# EAGLE schematic Tinker Slider v1.0 (EAGLE 9.0.0)
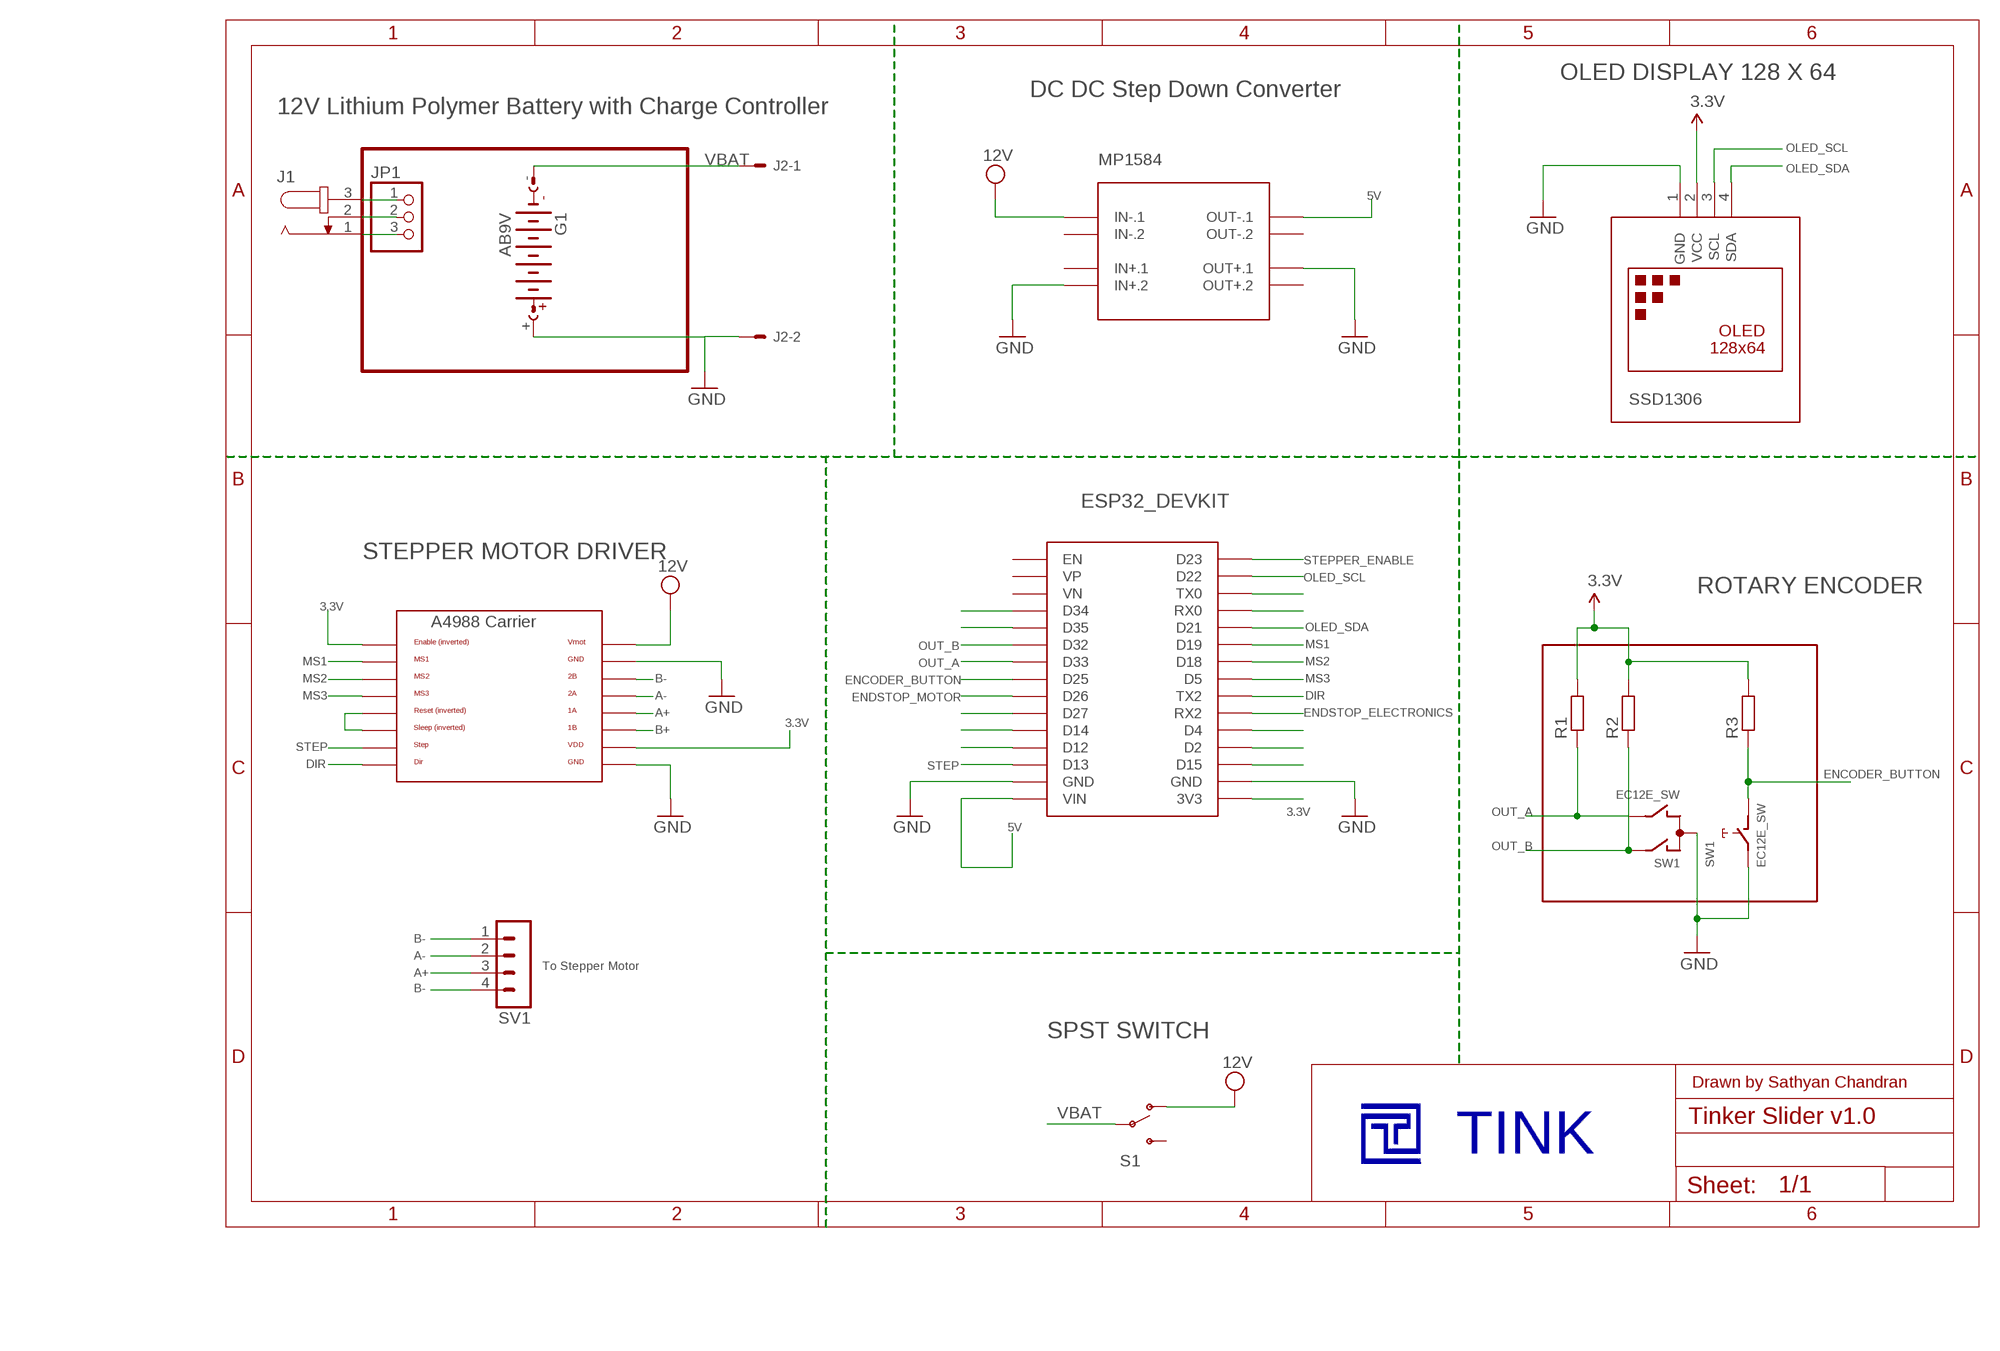
[diagram p0: schematic, sheet 1]

## Parts
G1  AB9V  [AB9V]
J1  JACK-PLUG0  [SPC4077]
J2  22-27-2021-02  [6410-02]
JP1  PINHD-1X3  [1X03]
MP1584  DC-DC-STEP-DOWN-MP1584  [DC-DC-STEP-DOWN-MP1584]
R1  R-EU_R0805  [R0805]
R2  R-EU_R0805  [R0805]
R3  R-EU_R0805  [R0805]
S1  SWITCH-SPSTKIT  [SWITCH-SPDT_KIT]
SSD1306  DISPLAY-OLED-128X64-I2C  [DISPLAY-OLED-128X64-I2C]
SV1  MA04-1  [MA04-1]
SW1  EC12E_SW  [ALPS_EC12E_SW]
U$3  ESP32_DEVKIT  [ESP32_DEVKIT]
U$5  A4983CARRIER  [A4988BREAKOUT]

## Nets
3.3V: U$3.3V3 U$5.EN U$5.VDD
5V: MP1584.OUT-.1 U$3.VIN
A+: SV1.3 U$5.1A
A-: SV1.2 U$5.2A
B+: U$5.1B
B-: SV1.1 SV1.4 U$5.2B
DIR: U$3.TX2 U$5.DIR
ENCODER_BUTTON: R3.1 SW1.D U$3.D25
ENDSTOP_ELECTRONICS: U$3.RX2
ENDSTOP_MOTOR: U$3.D26
GND: G1.+ J2.2 MP1584.IN+.2 MP1584.OUT+.1 SSD1306.1(GND) SW1.C SW1.E U$3.GND@1(GND) U$3.GND@2(GND) U$5.GND U$5.GND@0(GND)
MS1: U$3.D19 U$5.MS1
MS2: U$3.D18 U$5.MS2
MS3: U$3.D5 U$5.MS3
N$4: U$3.D34
N$5: U$3.D35
N$7: U$5.RST U$5.SLP(SLEEP)
N$10: U$3.D27
N$11: U$3.D14
N$12: U$3.D12
N$18: U$3.D15
N$19: U$3.D2
N$20: U$3.D4
N$27: U$3.RX0
N$28: U$3.TX0
N$31: J1.3 JP1.1
N$32: J1.2 JP1.2
N$33: J1.1 JP1.3
OLED_SCL: SSD1306.3(SCL) U$3.D22
OLED_SDA: SSD1306.4(SDA) U$3.D21
OUT_A: R1.1 SW1.B U$3.D33
OUT_B: R2.1 SW1.A U$3.D32
STEP: U$3.D13 U$5.STEP
STEPPER_ENABLE: U$3.D23
VBAT: G1.- J2.1 S1.2(P)
VCC: MP1584.IN-.1 R1.2 R2.2 R3.2 S1.1(O) SSD1306.2(VCC) U$5.VMOT ; supply symbol labelled 3.3V, 12V
Unconnected: MP1584.IN+.1 MP1584.IN-.2 MP1584.OUT+.2 MP1584.OUT-.2 S1.3(S) SW1.GND1(G) SW1.GND2(G) U$3.EN U$3.VN U$3.VP

## Notes on the sheet
- OLED DISPLAY 128 X 64
- DC DC Step Down Converter
- 12V Lithium Polymer Battery with Charge Controller
- STEPPER MOTOR DRIVER
- ROTARY ENCODER
- To Stepper Motor
- SPST SWITCH
- Drawn by Sathyan Chandran
- TINK
- F:/TinkMind/Website/bitmap.bmp

## Library data of the parts
G1 = battery:AB9V: 9-V BATTERY CLIP
J1 = con-jack:JACK-PLUG: DC POWER JACK Power Jack, DC, Right Angle, Through Hole, Rated 5A at 16VDC, PC Terminals Distributor: Farnell (www.Farnell.de) Drawing: 84N1161.pdf / 84N1162.pdf Manufacturer: SPC Technology (www.spctechnology.com) Type: SPC4077 / SPC 4078; OC_FARNELL: unknown; OC_NEWARK: unknown
J2 = con-molex:22-?-02: CONNECTOR wire to board 2.54 mm (.1 inch) pitch header; MF: MOLEX; OC_FARNELL: unknown; OC_NEWARK: unknown
JP1 = adafruit:PINHD-1X3: PIN HEADER
MP1584 = diy-modules:DC-DC-STEP-DOWN-MP1584: DC/DC Step-Down Regulator based on MP1584 chip MP1584 datasheet available here: http://www.haoyuelectronics.com/Attachment/MP1584/MP1584.pdf Click here to find device on ebay.com <http://www.ebay.com/sch/mp1584+module>
R1-R3 = Clean-Kong:R-EU_: RESISTOR, European symbol
S1 = SparkFun:SWITCH-SPST: SPST Switch Simple slide switch. Spark Fun Electronics SKU : COM-00102
SSD1306 = diy-modules:DISPLAY-OLED-128X64-I2C: 128x64 Dot Matrix OLED Module based on SSD1306 chip Variant with I2C interface More details available here: http://www.instructables.com/id/Monochrome-096-i2c-OLED-display-with-arduino-SSD13/ SSD1306 datasheet: https://cdn-shop.adafruit.com/datasheets/SSD1306.pdf Click here to find device on ebay.com <http://www.ebay.com/sch/oled+display+128x64+iic> Note: There are two variants: I2C and SPI. Search for the proper version.
SV1 = con-lstb:MA04-1: PIN HEADER; OC_FARNELL: unknown; OC_NEWARK: unknown
SW1 = switch-alps:EC12E_SW: ALPS rotary Encoder EC12E series with switch; MPN: EC12E2424407; OC_FARNELL: 1520813; OC_NEWARK: 74M1068
U$3 = DOIT_ESP32_DEVKIT:ESP32_DEVKIT: ESP32 DEVKIT BOARD
U$5 = RepRapjr:A4983CARRIER